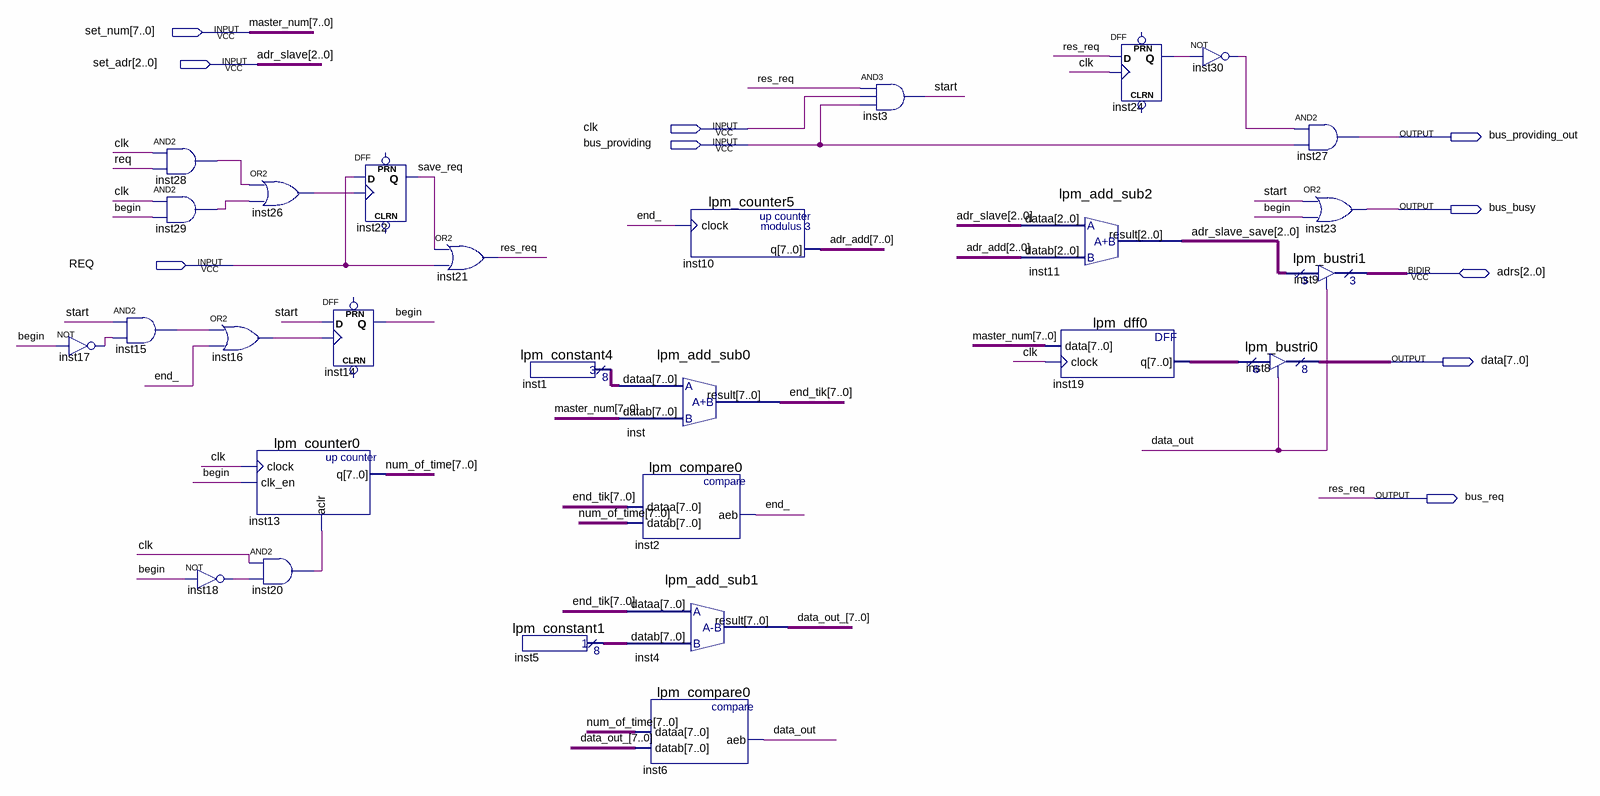
[diagram p0: schematic sheet]
// Quartus schematic master_device.bdf as structural Verilog: 28 symbols, 10 pins
module master_device (
  input  [7:0] set_num,
  input  [2:0] set_adr,
  input  clk,
  input  bus_providing,
  input  REQ,
  inout  [2:0] adrs,
  output bus_providing_out,
  output bus_busy,
  output [7:0] data,
  output bus_req
);

  wire \begin , data_out, end_, inst15_out, inst16_out, inst17_out, inst18_out, inst20_out, inst24_q,
       inst26_out, inst28_out, inst29_out, inst30_out, save_req, start;
  wire [2:0] adr_slave_save;
  wire [7:0] adr_add, data_out_, end_tik, inst1_result, inst5_result, inst19_q, num_of_time;

  not inst17 (inst17_out, \begin );
  and inst15 (inst15_out, start, inst17_out);
  and inst28 (inst28_out, clk, REQ);
  and inst29 (inst29_out, clk, \begin );
  not inst18 (inst18_out, \begin );
  or inst26 (inst26_out, inst28_out, inst29_out);
  or inst16 (inst16_out, inst15_out, end_);
  lpm_counter0 inst13 (.clock(clk), .clk_en(\begin ), .aclr(inst20_out), .q(num_of_time));
  and inst20 (inst20_out, clk, inst18_out);
  DFF inst22 (.CLK(inst26_out), .D(REQ), .Q(save_req));  // open: CLRN, PRN
  DFF inst14 (.CLK(inst16_out), .D(start), .Q(\begin ));  // open: CLRN, PRN
  or inst21 (bus_req, save_req, REQ);
  lpm_constant1 inst5 (.result(inst5_result));
  lpm_constant4 inst1 (.result(inst1_result));
  lpm_add_sub0 inst (.dataa(inst1_result), .datab(set_num), .result(end_tik));
  lpm_compare0 inst2 (.dataa(end_tik), .datab(num_of_time), .aeb(end_));
  lpm_add_sub1 inst4 (.dataa(end_tik), .datab(inst5_result), .result(data_out_));
  lpm_compare0 inst6 (.dataa(num_of_time), .datab(data_out_), .aeb(data_out));
  lpm_counter5 inst10 (.clock(end_), .q(adr_add));
  and inst3 (start, bus_req, clk, bus_providing);
  lpm_add_sub2 inst11 (.dataa(set_adr), .datab(adr_add[2:0]), .result(adr_slave_save));
  lpm_dff0 inst19 (.data(set_num), .clock(clk), .q(inst19_q));
  DFF inst24 (.CLK(clk), .D(bus_req), .Q(inst24_q));  // open: CLRN, PRN
  not inst30 (inst30_out, inst24_q);
  lpm_bustri0 inst8 (.enabledt(data_out), .data(inst19_q), .tridata(data));
  and inst27 (bus_providing_out, inst30_out, bus_providing);
  or inst23 (bus_busy, start, \begin );
  lpm_bustri1 inst9 (.enabledt(data_out), .data(adr_slave_save), .tridata(adrs));

  // Other names for the same wires on the sheet: adr_slave[2:0] = set_adr; master_num[7:0] = set_num;
  //   res_req = bus_req
endmodule
